# Altium schematic sheet Kvant3DPrinter.SchDoc
size A4
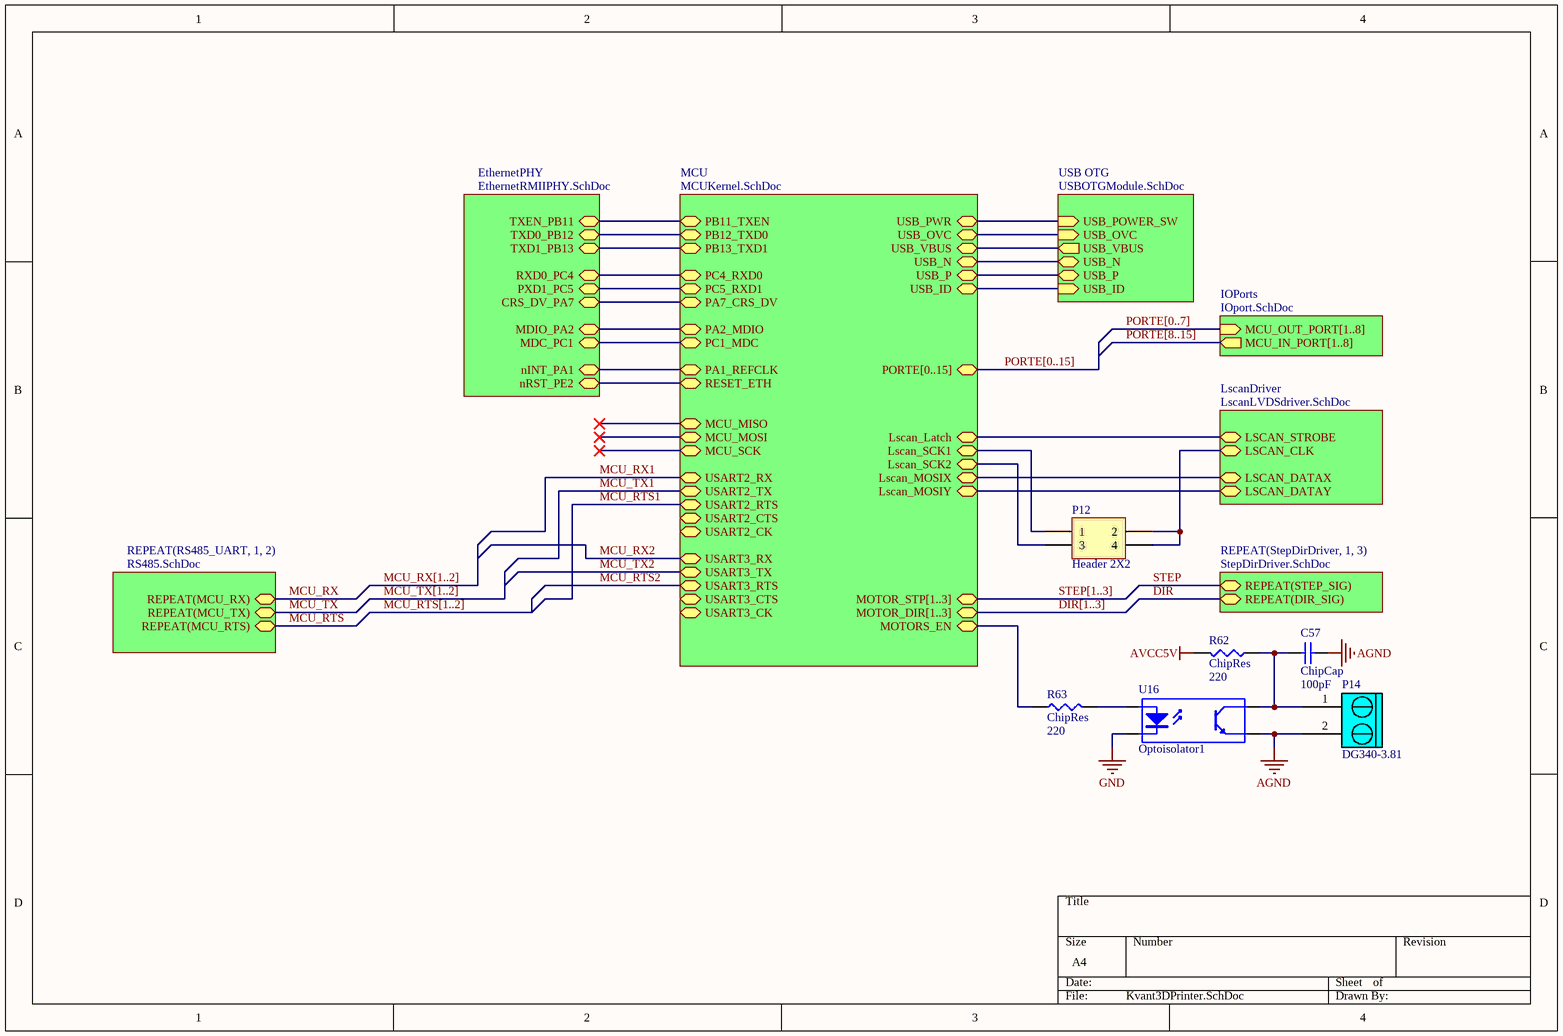
[diagram p0: Kvant3DPrinter.SchDoc]

## Parts
C57  ChipCap  value 100pF  [CAP0805]
P12  Header 2X2  [HDR2X2]
P14  DG340-3.81  [DG340-3.81-02P-00A(H)]
R62  ChipRes  value 220  [RES0805]
R63  ChipRes  value 220  [RES0805]
U16  Optoisolator1  [DIP-4]

## Sub-sheets
EthernetPHY = EthernetRMIIPHY.SchDoc: TXEN_PB11, TXD0_PB12, TXD1_PB13, RXD0_PC4, PXD1_PC5, CRS_DV_PA7, MDIO_PA2, MDC_PC1, nINT_PA1, nRST_PE2
IOPorts = IOport.SchDoc: MCU_OUT_PORT[1..8] (in), MCU_IN_PORT[1..8] (out)
LscanDriver = LscanLVDSdriver.SchDoc: LSCAN_STROBE, LSCAN_CLK, LSCAN_DATAX, LSCAN_DATAY
MCU = MCUKernel.SchDoc: RESET_ETH, USB_PWR, USB_OVC, USB_VBUS, USB_N, USB_P, USB_ID, MCU_SCK, MCU_MISO, MCU_MOSI, PORTE[0..15] (bidir), PA2_MDIO, PC1_MDC, PA1_REFCLK, PA7_CRS_DV, PB11_TXEN, PB12_TXD0, PB13_TXD1, PC4_RXD0, PC5_RXD1, Lscan_Latch, Lscan_SCK1, Lscan_SCK2, Lscan_MOSIX, Lscan_MOSIY, USART2_CTS, USART2_RTS, USART2_TX, USART2_RX, USART2_CK, USART3_TX, USART3_RX, USART3_CK, USART3_CTS, USART3_RTS, MOTORS_EN, MOTOR_STP[1..3], MOTOR_DIR[1..3]
REPEAT(RS485_UART, 1, 2) = RS485.SchDoc: REPEAT(MCU_RX), REPEAT(MCU_TX), REPEAT(MCU_RTS)
REPEAT(StepDirDriver, 1, 3) = StepDirDriver.SchDoc: REPEAT(STEP_SIG), REPEAT(DIR_SIG)
USB OTG = USBOTGModule.SchDoc: USB_POWER_SW (in), USB_OVC (in), USB_VBUS (out), USB_N (bidir), USB_P (bidir), USB_ID (in)

## Nets
AGND: C57.2 P14.2 U16.3(E)
AVCC5V: R62.2
GND: U16.2(K)
DIR: sheet REPEAT(StepDirDriver, 1, 3)/REPEAT(DIR_SIG)
MCU_RTS: sheet REPEAT(RS485_UART, 1, 2)/REPEAT(MCU_RTS)
MCU_RTS1: sheet MCU/USART2_RTS
MCU_RTS2: sheet MCU/USART3_RTS
MCU_RX: sheet REPEAT(RS485_UART, 1, 2)/REPEAT(MCU_RX)
MCU_RX1: sheet MCU/USART2_RX
MCU_RX2: sheet MCU/USART3_RX
MCU_TX: sheet REPEAT(RS485_UART, 1, 2)/REPEAT(MCU_TX)
MCU_TX1: sheet MCU/USART2_TX
MCU_TX2: sheet MCU/USART3_TX
STEP: sheet REPEAT(StepDirDriver, 1, 3)/REPEAT(STEP_SIG)
NetC57_1: C57.1 P14.1 R62.1 U16.4(C)
NetP12_1: P12.1 ; sheet MCU/Lscan_SCK1
NetP12_2: P12.2 P12.4 ; sheet LscanDriver/LSCAN_CLK
NetP12_3: P12.3 ; sheet MCU/Lscan_SCK2
NetR63_1: R63.1 ; sheet MCU/MOTORS_EN
NetR63_2: R63.2 U16.1(A)
(unnamed): sheet MCU/RESET_ETH, sheet EthernetPHY/nRST_PE2
(unnamed): sheet MCU/USB_PWR, sheet USB OTG/USB_POWER_SW
(unnamed): sheet MCU/USB_OVC, sheet USB OTG/USB_OVC
(unnamed): sheet MCU/USB_VBUS, sheet USB OTG/USB_VBUS
(unnamed): sheet MCU/USB_N, sheet USB OTG/USB_N
(unnamed): sheet MCU/USB_P, sheet USB OTG/USB_P
(unnamed): sheet MCU/USB_ID, sheet USB OTG/USB_ID
(unnamed): sheet MCU/PA2_MDIO, sheet EthernetPHY/MDIO_PA2
(unnamed): sheet MCU/PC1_MDC, sheet EthernetPHY/MDC_PC1
(unnamed): sheet MCU/PA1_REFCLK, sheet EthernetPHY/nINT_PA1
(unnamed): sheet MCU/PA7_CRS_DV, sheet EthernetPHY/CRS_DV_PA7
(unnamed): sheet MCU/PB11_TXEN, sheet EthernetPHY/TXEN_PB11
(unnamed): sheet MCU/PB12_TXD0, sheet EthernetPHY/TXD0_PB12
(unnamed): sheet MCU/PB13_TXD1, sheet EthernetPHY/TXD1_PB13
(unnamed): sheet MCU/PC4_RXD0, sheet EthernetPHY/RXD0_PC4
(unnamed): sheet MCU/PC5_RXD1, sheet EthernetPHY/PXD1_PC5
(unnamed): sheet MCU/Lscan_Latch, sheet LscanDriver/LSCAN_STROBE
(unnamed): sheet MCU/Lscan_MOSIX, sheet LscanDriver/LSCAN_DATAX
(unnamed): sheet MCU/Lscan_MOSIY, sheet LscanDriver/LSCAN_DATAY

## Buses and harness runs
bus DIR[1..3] = sheet MCU/MOTOR_DIR[1..3]
bus MCU_RTS[1..2]
bus MCU_RX[1..2]
bus MCU_TX[1..2]
bus PORTE[0..7] = sheet IOPorts/MCU_OUT_PORT[1..8]
bus PORTE[0..15] = sheet MCU/PORTE[0..15]
bus PORTE[8..15] = sheet IOPorts/MCU_IN_PORT[1..8]
bus STEP[1..3] = sheet MCU/MOTOR_STP[1..3]

## Library data of the parts
C57 = ChipCap: Capacitor; Published: 8-Jun-2000; LatestRevisionDate: 17-Jul-2002; LatestRevisionNote: Re-released for DXP Platform.; PackageReference: RAD-0.3; Publisher: Altium Limited
P12 = Header 2X2: Header, 2-Pin, Dual row; LatestRevisionDate: 17-Jul-2002; LatestRevisionNote: Re-released for DXP Platform.; Publisher: Altium Limited
P14 = DG340-3.81-02P: Terminal block
R62 R63 = ChipRes: Chip resistor
U16 = Optoisolator1: 4-Pin Phototransistor Optocoupler; Published: 24-Mar-1999; LatestRevisionDate: 04-Mar-2005; LatestRevisionNote: Sch pins 3 & 4 Swapped.; DatasheetVersion: Nov-2003; PackageReference: DIP-4; Publisher: Altium Limited